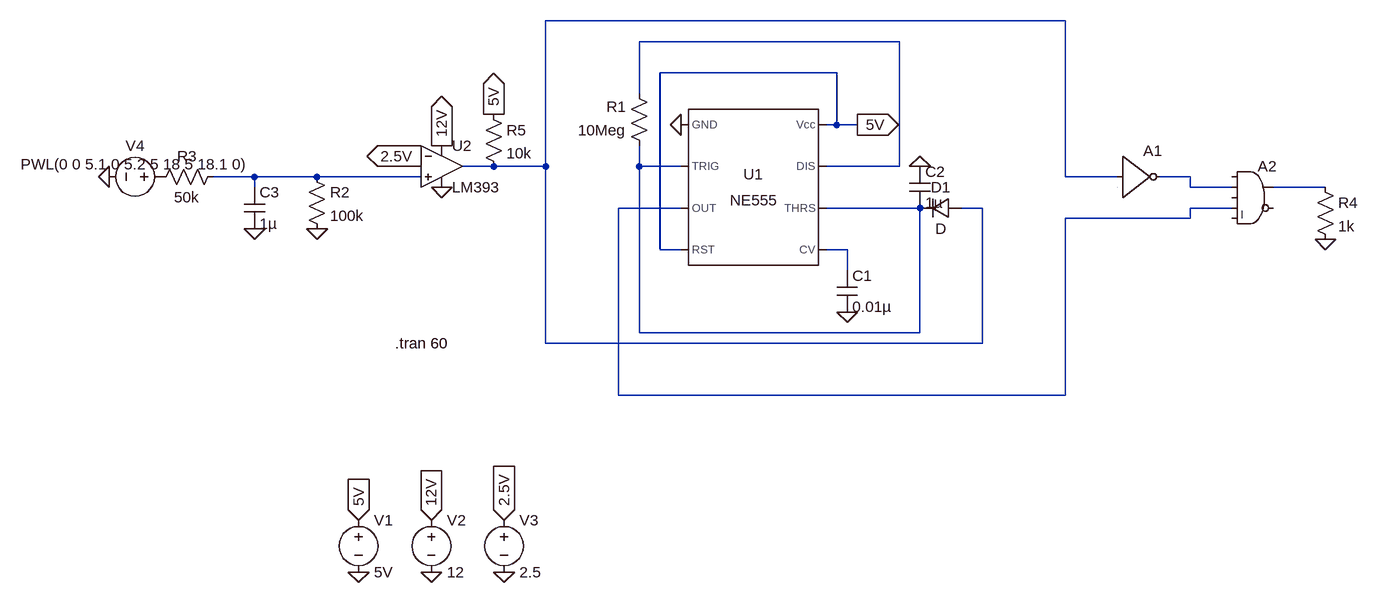
[diagram p0: schematic Timing.asc]
Timing.asc, the LTspice schematic file:
Version 4
SHEET 1 1064 840
WIRE 608 -48 -192 -48
WIRE 352 -16 -48 -16
WIRE 256 32 -16 32
WIRE -48 64 -48 -16
WIRE 256 112 256 32
WIRE 256 112 240 112
WIRE 288 112 256 112
WIRE -272 176 -320 176
WIRE -192 176 -192 -48
WIRE -192 176 -272 176
WIRE -48 176 -48 144
WIRE 16 176 -48 176
WIRE 352 176 352 -16
WIRE 352 176 240 176
WIRE -640 192 -704 192
WIRE -544 192 -640 192
WIRE -384 192 -544 192
WIRE 608 192 608 -48
WIRE 688 192 608 192
WIRE 800 192 752 192
WIRE -640 208 -640 192
WIRE 800 208 800 192
WIRE 864 208 800 208
WIRE 1008 208 928 208
WIRE 16 240 -80 240
WIRE 384 240 240 240
WIRE 480 240 448 240
WIRE 864 240 800 240
WIRE 800 256 800 240
WIRE 800 256 608 256
WIRE -16 304 -16 32
WIRE 16 304 -16 304
WIRE 272 304 240 304
WIRE 272 336 272 304
WIRE -48 432 -48 176
WIRE 384 432 384 240
WIRE 384 432 -48 432
WIRE -192 448 -192 176
WIRE 480 448 480 240
WIRE 480 448 -192 448
WIRE -80 528 -80 240
WIRE 608 528 608 256
WIRE 608 528 -80 528
FLAG 16 112 0
FLAG -480 720 5V
IOPIN -480 720 In
FLAG -480 800 0
FLAG 288 112 5V
IOPIN 288 112 Out
FLAG 272 400 0
FLAG 384 176 0
FLAG -352 208 0
FLAG -352 144 12V
IOPIN -352 144 Out
FLAG -368 800 0
FLAG -368 720 12V
IOPIN -368 720 In
FLAG -256 800 0
FLAG -256 720 2.5V
IOPIN -256 720 In
FLAG -384 160 2.5V
IOPIN -384 160 Out
FLAG -640 272 0
FLAG -544 272 0
FLAG -864 192 0
FLAG 1008 288 0
FLAG -272 96 5V
IOPIN -272 96 Out
SYMBOL Misc\\NE555 128 208 R0
SYMATTR InstName U1
SYMBOL voltage -480 704 R0
WINDOW 123 0 0 Left 0
WINDOW 39 0 0 Left 0
SYMATTR InstName V1
SYMATTR Value 5V
SYMBOL cap 256 336 R0
SYMATTR InstName C1
SYMATTR Value 0.01µ
SYMATTR SpiceLine V=10 Irms=0 Rser=0.0697 Lser=689p mfg="Würth Elektronik" pn="885012208008 WCAP-CSGP 1206" type="X7R"
SYMBOL cap 368 176 R0
SYMATTR InstName C2
SYMATTR Value 1µ
SYMATTR SpiceLine V=6.3 Irms=0 Rser=0.0058 Lser=800p mfg="Würth Elektronik" pn="885012105020 WCAP-CSGP 0402" type="X5R"
SYMBOL res -32 160 R180
WINDOW 0 36 76 Left 2
WINDOW 3 36 40 Left 2
SYMATTR InstName R1
SYMATTR Value 10Meg
SYMBOL voltage -368 704 R0
WINDOW 123 0 0 Left 0
WINDOW 39 0 0 Left 0
SYMATTR InstName V2
SYMATTR Value 12
SYMBOL voltage -256 704 R0
WINDOW 123 0 0 Left 0
WINDOW 39 0 0 Left 0
SYMATTR InstName V3
SYMATTR Value 2.5
SYMBOL res -560 176 R0
SYMATTR InstName R2
SYMATTR Value 100k
SYMBOL res -688 176 R90
WINDOW 0 0 56 VBottom 2
WINDOW 3 32 56 VTop 2
SYMATTR InstName R3
SYMATTR Value 50k
SYMBOL cap -656 208 R0
SYMATTR InstName C3
SYMATTR Value 1µ
SYMATTR SpiceLine V=16 Irms=11 Rser=0.00378043 Lser=0
SYMBOL voltage -768 192 R90
WINDOW 0 -32 56 VBottom 2
WINDOW 3 -4 56 VBottom 2
WINDOW 123 0 0 Left 0
WINDOW 39 0 0 Left 0
SYMATTR InstName V4
SYMATTR Value PWL(0 0 5.1 0 5.2 5 18 5 18.1 0)
SYMBOL Digital\\inv 688 128 R0
SYMATTR InstName A1
SYMBOL Digital\\and 896 160 R0
SYMATTR InstName A2
SYMBOL res 992 192 R0
SYMATTR InstName R4
SYMATTR Value 1k
SYMBOL res -288 80 R0
SYMATTR InstName R5
SYMATTR Value 10k
SYMBOL diode 448 224 R90
WINDOW 0 0 32 VBottom 2
WINDOW 3 32 32 VTop 2
SYMATTR InstName D1
SYMBOL ZZZ\\Comparator\\lm393 -352 176 R0
SYMATTR InstName U2
TEXT -424 448 Left 2 !.tran 60

The netlist it stands for:
* Timing.asc
XU1 0 N003 N007 5V N008 N003 N002 5V NE555  ; pins GND TRIG OUT RST CV THRS DIS Vcc
V1 5V 0 5V
C1 N008 0 0.01µ V=10 Irms=0 Rser=0.0697 Lser=689p mfg="Würth Elektronik" pn="885012208008 WCAP-CSGP 1206" type="X7R"
C2 0 N003 1µ V=6.3 Irms=0 Rser=0.0058 Lser=800p mfg="Würth Elektronik" pn="885012105020 WCAP-CSGP 0402" type="X5R"
R1 N003 N002 10Meg
V2 12V 0 12
V3 2.5V 0 2.5
R2 N004 0 100k
R3 N004 P001 50k
C3 N004 0 1µ V=16 Irms=11 Rser=0.00378043 Lser=0
V4 P001 0 PWL(0 0 5.1 0 5.2 5 18 5 18.1 0)
A1 N001 0 0 0 0 N005 0 0 BUF
A2 0 N005 0 N007 0 0 N006 0 AND
R4 N006 0 1k
R5 5V N001 10k
D1 N001 N003 D
XU2 N004 2.5V 12V 0 N001 LM393  ; pins In+ In- V+ V- OUT
.model D D
.lib standard.dio
.tran 60
.lib NE555.sub
.backanno
.end